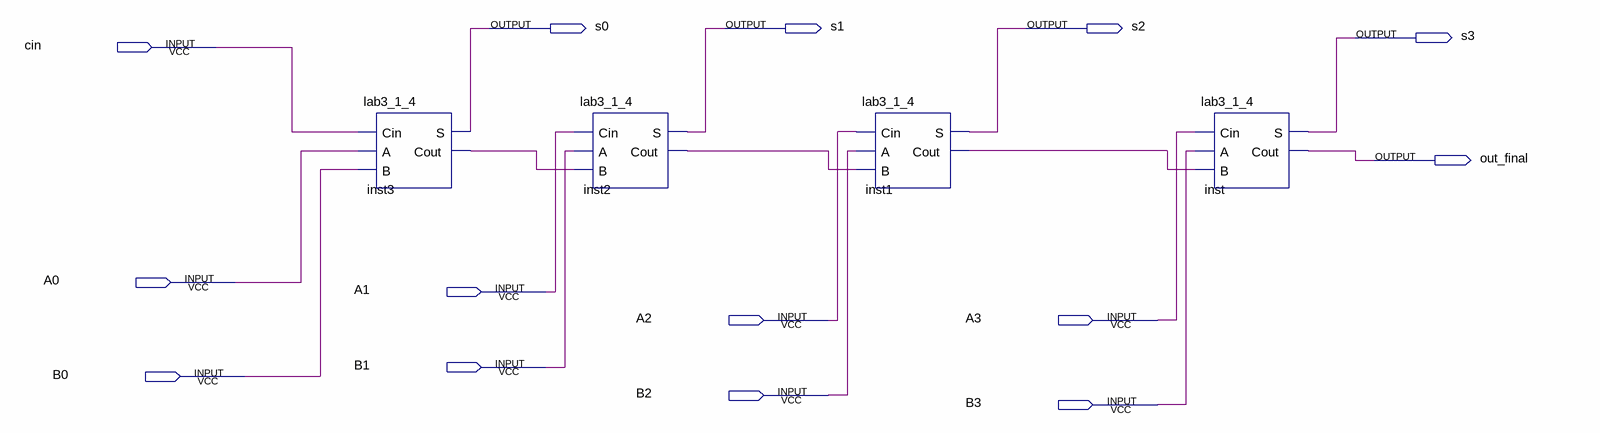
[diagram p0: schematic sheet]
// Quartus schematic lab3_1_5.bdf as structural Verilog: 4 symbols, 14 pins
module lab3_1_5 (
  input  cin,
  input  A0,
  input  A1,
  input  A2,
  input  A3,
  input  B1,
  input  B0,
  input  B2,
  input  B3,
  output s0,
  output s1,
  output s2,
  output s3,
  output out_final
);

  wire inst1_cout, inst2_cout, inst3_cout;

  lab3_1_4 inst3 (.Cin(cin), .A(A0), .B(B0), .S(s0), .Cout(inst3_cout));
  lab3_1_4 inst2 (.Cin(A1), .A(B1), .B(inst3_cout), .S(s1), .Cout(inst2_cout));
  lab3_1_4 inst1 (.Cin(A2), .A(B2), .B(inst2_cout), .S(s2), .Cout(inst1_cout));
  lab3_1_4 inst (.Cin(A3), .A(B3), .B(inst1_cout), .S(s3), .Cout(out_final));
endmodule
